# Altium schematic sheet isa_svga.SchDoc
size 431 x 279 mm
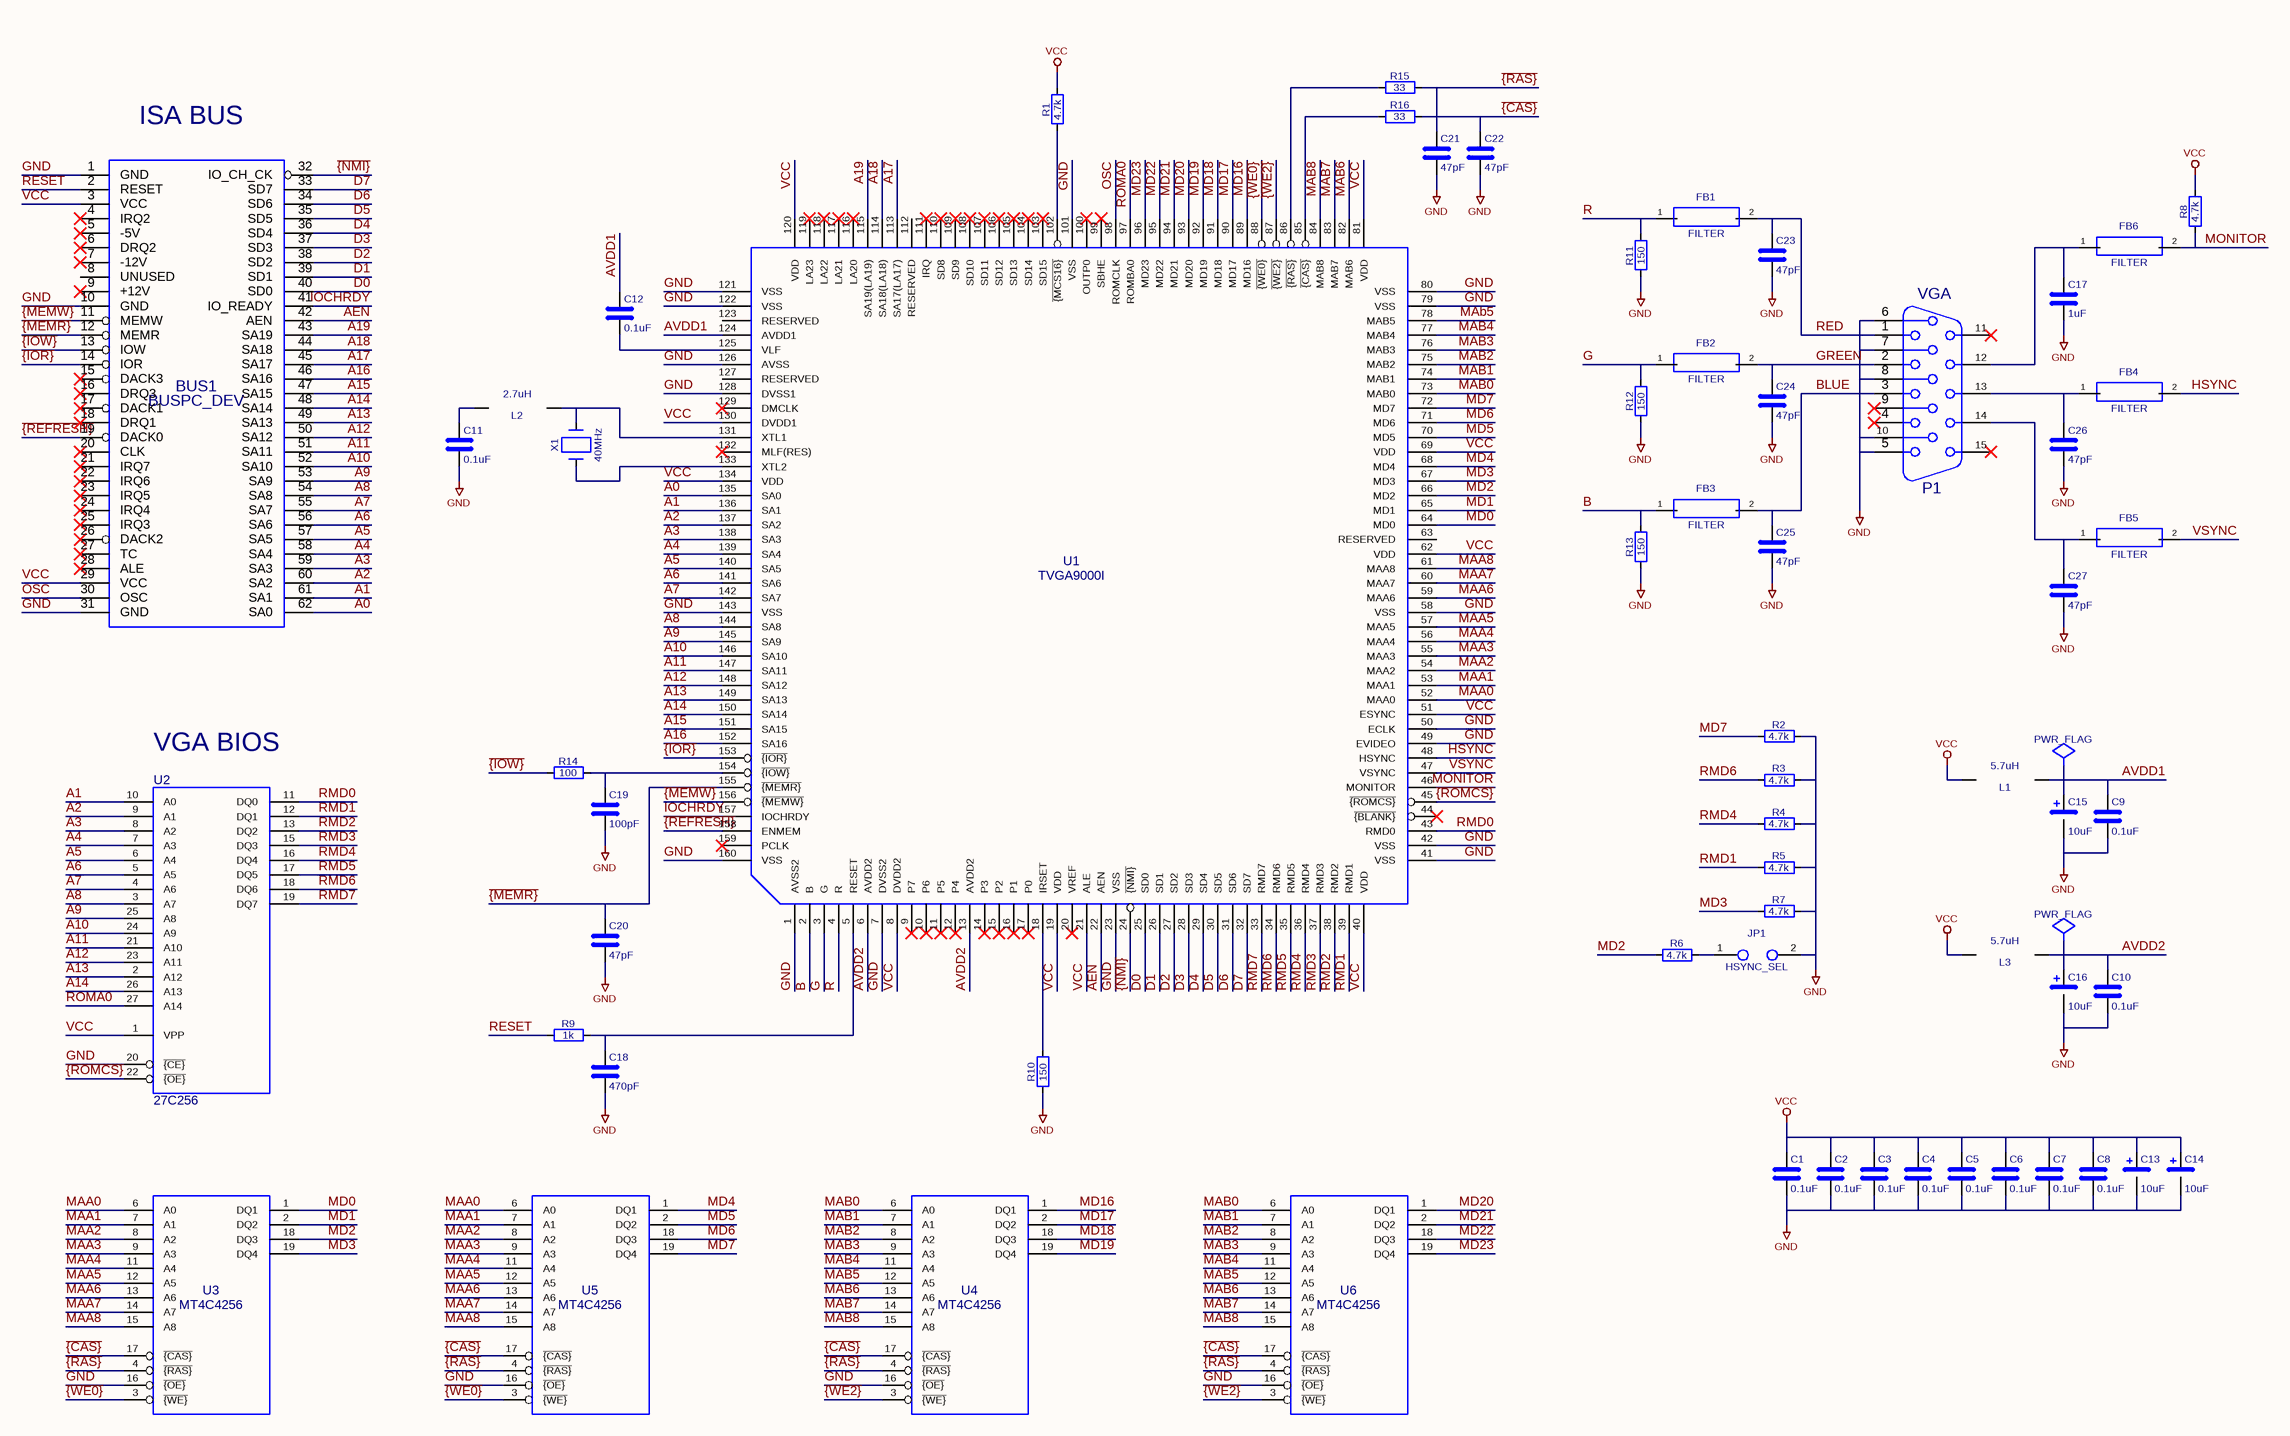
[diagram p0: isa_svga.SchDoc]

## Parts
#FLG021  PWR_FLAG  (graphical)
#FLG022  PWR_FLAG  (graphical)
BUS1  BUSPC_DEV  [Conn_Edge_ISA8]
C1  0.1uF  [Cap_Cer_508]
C2  0.1uF  [Cap_Cer_508]
C3  0.1uF  [Cap_Cer_508]
C4  0.1uF  [Cap_Cer_508]
C5  0.1uF  [Cap_Cer_508]
C6  0.1uF  [Cap_Cer_508]
C7  0.1uF  [Cap_Cer_508]
C8  0.1uF  [Cap_Cer_508]
C9  0.1uF  [Cap_Cer_508]
C10  0.1uF  [Cap_Cer_508]
C11  0.1uF  [Cap_Cer_508]
C12  0.1uF  [Cap_Cer_508]
C13  10uF  [Cap_Tant_508]
C14  10uF  [Cap_Tant_508]
C15  10uF  [Cap_Tant_508]
C16  10uF  [Cap_Tant_508]
C17  1uF  [Cap_Cer_508]
C18  470pF  [Cap_Cer_508]
C19  100pF  [Cap_Cer_508]
C20  47pF  [Cap_Cer_508]
C21  47pF  [Cap_Cer_508]
C22  47pF  [Cap_Cer_508]
C23  47pF  [Cap_Cer_508]
C24  47pF  [Cap_Cer_508]
C25  47pF  [Cap_Cer_508]
C26  47pF  [Cap_Cer_508]
C27  47pF  [Cap_Cer_508]
FB1  FILTER  [Res_1016]
FB2  FILTER  [Res_1016]
FB3  FILTER  [Res_1016]
FB4  FILTER  [Res_1016]
FB5  FILTER  [Res_1016]
FB6  FILTER  [Res_1016]
JP1  HSYNC_SEL  [Conn_Pin_Header_2x1_2.54mm_NoKey]
L1  5.7uH  [Res_1016]
L2  2.7uH  [Res_1016]
L3  5.7uH  [Res_1016]
P1  VGA  [Conn_Dsub_DE15F]
R1  4.7k  [Res_762]
R2  4.7k  [Res_762]
R3  4.7k  [Res_762]
R4  4.7k  [Res_762]
R5  4.7k  [Res_762]
R6  4.7k  [Res_762]
R7  4.7k  [Res_762]
R8  4.7k  [Res_762]
R9  1k  [Res_762]
R10  150  [Res_762]
R11  150  [Res_762]
R12  150  [Res_762]
R13  150  [Res_762]
R14  100  [Res_762]
R15  33  [Res_762]
R16  33  [Res_762]
U1  TVGA9000I  [IC_PQFP-160]
U2  27C256  [IC_DIP28_600]
U3  MT4C4256  [IC_DIP20_300]
U4  MT4C4256  [IC_DIP20_300]
U5  MT4C4256  [IC_DIP20_300]
U6  MT4C4256  [IC_DIP20_300]
X1  40MHz  [Crystal_HC-49U_Vert]

## Nets
GND: BUS1.1(GND) BUS1.10(GND) BUS1.31(GND) C1.2 C2.2 C3.2 C4.2 C5.2 C6.2 C7.2 C8.2 C9.2 C10.2 C11.2 C13.2 C14.2 C15.2 C16.2 C17.2 C18.2 C19.2 C20.2 C21.2 C22.2 C23.2 C24.2 C25.2 C26.2 C27.2 JP1.2 P1.5 P1.6(P6) P1.7(P7) P1.8(P8) P1.10 R2.2 R3.2 R4.2 R5.2 R7.2 R10.2 R11.2 R12.2 R13.2 U1.1(AVSS2) U1.7(DVSS2) U1.23(VSS) U1.41(VSS) U1.42(VSS) U1.49(EVIDEO) U1.50(ECLK) U1.58(VSS) U1.79(VSS) U1.80(VSS) U1.101(VSS) U1.121(VSS) U1.122(VSS) U1.126(AVSS) U1.128(DVSS1) U1.143(VSS) U1.160(VSS) U2.20(~{{CE}}) U3.16(~{{OE}}) U4.16(~{{OE}}) U5.16(~{{OE}}) U6.16(~{{OE}})
VCC: BUS1.3(VCC) BUS1.29(VCC) C1.1 C2.1 C3.1 C4.1 C5.1 C6.1 C7.1 C8.1 C13.1 C14.1 L1.1 L3.1 R1.2 R8.2 U1.8(DVDD2) U1.19(VDD) U1.21(ALE) U1.40(VDD) U1.51(ESYNC) U1.62(VDD) U1.69(VDD) U1.81(VDD) U1.120(VDD) U1.130(DVDD1) U1.134(VDD) U2.1(VPP)
A0: BUS1.62(SA0) U1.135(SA0)
A1: BUS1.61(SA1) U1.136(SA1) U2.10(A0)
A2: BUS1.60(SA2) U1.137(SA2) U2.9(A1)
A3: BUS1.59(SA3) U1.138(SA3) U2.8(A2)
A4: BUS1.58(SA4) U1.139(SA4) U2.7(A3)
A5: BUS1.57(SA5) U1.140(SA5) U2.6(A4)
A6: BUS1.56(SA6) U1.141(SA6) U2.5(A5)
A7: BUS1.55(SA7) U1.142(SA7) U2.4(A6)
A8: BUS1.54(SA8) U1.144(SA8) U2.3(A7)
A9: BUS1.53(SA9) U1.145(SA9) U2.25(A8)
A10: BUS1.52(SA10) U1.146(SA10) U2.24(A9)
A11: BUS1.51(SA11) U1.147(SA11) U2.21(A10)
A12: BUS1.50(SA12) U1.148(SA12) U2.23(A11)
A13: BUS1.49(SA13) U1.149(SA13) U2.2(A12)
A14: BUS1.48(SA14) U1.150(SA14) U2.26(A13)
A15: BUS1.47(SA15) U1.151(SA15)
A16: BUS1.46(SA16) U1.152(SA16)
A17: BUS1.45(SA17) U1.113(SA17(LA17))
A18: BUS1.44(SA18) U1.114(SA18(LA18))
A19: BUS1.43(SA19) U1.115(SA19(LA19))
AEN: BUS1.42(AEN) U1.22(AEN)
AVDD1: #FLG021.1(pwr) C9.1 C12.1 C15.1 L1.2 U1.124(AVDD1)
AVDD2: #FLG022.1(pwr) C10.1 C16.1 L3.2 U1.6(AVDD2) U1.13(AVDD2)
B: FB3.1 R13.1 U1.2(B)
BLUE: C25.1 FB3.2 P1.3
D0: BUS1.40(SD0) U1.25(SD0)
D1: BUS1.39(SD1) U1.26(SD1)
D2: BUS1.38(SD2) U1.27(SD2)
D3: BUS1.37(SD3) U1.28(SD3)
D4: BUS1.36(SD4) U1.29(SD4)
D5: BUS1.35(SD5) U1.30(SD5)
D6: BUS1.34(SD6) U1.31(SD6)
D7: BUS1.33(SD7) U1.32(SD7)
G: FB2.1 R12.1 U1.3(G)
GREEN: C24.1 FB2.2 P1.2
HSYNC: FB4.2 U1.48(HSYNC)
IOCHRDY: BUS1.41(IO_READY) U1.157(IOCHRDY)
MAA0: U1.52(MAA0) U3.6(A0) U5.6(A0)
MAA1: U1.53(MAA1) U3.7(A1) U5.7(A1)
MAA2: U1.54(MAA2) U3.8(A2) U5.8(A2)
MAA3: U1.55(MAA3) U3.9(A3) U5.9(A3)
MAA4: U1.56(MAA4) U3.11(A4) U5.11(A4)
MAA5: U1.57(MAA5) U3.12(A5) U5.12(A5)
MAA6: U1.59(MAA6) U3.13(A6) U5.13(A6)
MAA7: U1.60(MAA7) U3.14(A7) U5.14(A7)
MAA8: U1.61(MAA8) U3.15(A8) U5.15(A8)
MAB0: U1.73(MAB0) U4.6(A0) U6.6(A0)
MAB1: U1.74(MAB1) U4.7(A1) U6.7(A1)
MAB2: U1.75(MAB2) U4.8(A2) U6.8(A2)
MAB3: U1.76(MAB3) U4.9(A3) U6.9(A3)
MAB4: U1.77(MAB4) U4.11(A4) U6.11(A4)
MAB5: U1.78(MAB5) U4.12(A5) U6.12(A5)
MAB6: U1.82(MAB6) U4.13(A6) U6.13(A6)
MAB7: U1.83(MAB7) U4.14(A7) U6.14(A7)
MAB8: U1.84(MAB8) U4.15(A8) U6.15(A8)
MD0: U1.64(MD0) U3.1(DQ1)
MD1: U1.65(MD1) U3.2(DQ2)
MD2: R6.1 U1.66(MD2) U3.18(DQ3)
MD3: R7.1 U1.67(MD3) U3.19(DQ4)
MD4: U1.68(MD4) U5.1(DQ1)
MD5: U1.70(MD5) U5.2(DQ2)
MD6: U1.71(MD6) U5.18(DQ3)
MD7: R2.1 U1.72(MD7) U5.19(DQ4)
MD16: U1.89(MD16) U4.1(DQ1)
MD17: U1.90(MD17) U4.2(DQ2)
MD18: U1.91(MD18) U4.18(DQ3)
MD19: U1.92(MD19) U4.19(DQ4)
MD20: U1.93(MD20) U6.1(DQ1)
MD21: U1.94(MD21) U6.2(DQ2)
MD22: U1.95(MD22) U6.18(DQ3)
MD23: U1.96(MD23) U6.19(DQ4)
MONITOR: FB6.2 R8.1 U1.46(MONITOR)
OSC: BUS1.30(OSC) U1.98(ROMCLK)
R: FB1.1 R11.1 U1.4(R)
RED: C23.1 FB1.2 P1.1
RESET: BUS1.2(RESET) R9.1
RMD0: U1.43(RMD0) U2.11(DQ0)
RMD1: R5.1 U1.39(RMD1) U2.12(DQ1)
RMD2: U1.38(RMD2) U2.13(DQ2)
RMD3: U1.37(RMD3) U2.15(DQ3)
RMD4: R4.1 U1.36(RMD4) U2.16(DQ4)
RMD5: U1.35(RMD5) U2.17(DQ5)
RMD6: R3.1 U1.34(RMD6) U2.18(DQ6)
RMD7: U1.33(RMD7) U2.19(DQ7)
ROMA0: U1.97(ROMBA0) U2.27(A14)
VSYNC: FB5.2 U1.47(VSYNC)
~{{CAS}}: C22.1 R16.2 U3.17(~{{CAS}}) U4.17(~{{CAS}}) U5.17(~{{CAS}}) U6.17(~{{CAS}})
~{{IOR}}: BUS1.14(IOR) U1.153(~{{IOR}})
~{{IOW}}: BUS1.13(IOW) R14.1
~{{MEMR}}: BUS1.12(MEMR) C20.1 U1.155(~{{MEMR}})
~{{MEMW}}: BUS1.11(MEMW) U1.156(~{{MEMW}})
~{{NMI}}: BUS1.32(IO_CH_CK) U1.24(~{{NMI}})
~{{RAS}}: C21.1 R15.2 U3.4(~{{RAS}}) U4.4(~{{RAS}}) U5.4(~{{RAS}}) U6.4(~{{RAS}})
~{{REFRESH}}: BUS1.19(DACK0) U1.158(ENMEM)
~{{ROMCS}}: U1.45(~{{ROMCS}}) U2.22(~{{OE}})
~{{WE0}}: U1.88(~{{WE0}}) U3.3(~{{WE}}) U5.3(~{{WE}})
~{{WE2}}: U1.87(~{{WE2}}) U4.3(~{{WE}}) U6.3(~{{WE}})
NetC11_1: C11.1 L2.1
NetC12_2: C12.2 U1.125(VLF)
NetC17_1: C17.1 FB6.1 P1.12
NetC18_1: C18.1 R9.2 U1.5(RESET)
NetC19_1: C19.1 R14.2 U1.154(~{{IOW}})
NetC26_1: C26.1 FB4.1 P1.13
NetC27_1: C27.1 FB5.1 P1.14
NetJP1_1: JP1.1 R6.2
NetL2_2: L2.2 U1.131(XTL1) X1.2
NetR1_1: R1.1 U1.102(~{{MCS16}})
NetR10_1: R10.1 U1.18(IRSET)
NetR15_1: R15.1 U1.86(~{{RAS}})
NetR16_1: R16.1 U1.85(~{{CAS}})
NetU1_133: U1.133(XTL2) X1.1

Not connected (* = marked no-connect by the designer): BUS1 4(IRQ2)* 5(-5V)* 6(DRQ2)* 7(-12V)* 8(UNUSED) 9(+12V)* 15(DACK3)* 16(DRQ3)* 17(DACK1)* 18(DRQ1)* 20(CLK)* 21(IRQ7)* 22(IRQ6)* 23(IRQ5)* 24(IRQ4)* 25(IRQ3)* 26(DACK2)* 27(TC)* 28(ALE)*; P1 4* 9(P9)* 11* 15*; U1 9(P7)* 10(P6)* 11(P5)* 12(P4)* 14(P3)* 15(P2)* 16(P1)* 17(P0)* 20(VREF)* 44(~{{BLANK}})* 63(RESERVED) 99(SBHE)* 100(OUTP0)* 103(SD15)* 104(SD14)* 105(SD13)* 106(SD12)* 107(SD11)* 108(SD10)* 109(SD9)* 110(SD8)* 111(IRQ)* 112(RESERVED) 116(LA20)* 117(LA21)* 118(LA22)* 119(LA23)* 123(RESERVED) 127(RESERVED) 129(DMCLK)* 132(MLF(RES))* 159(PCLK)*; U2 14(GND) 28(VCC); U3 5(NC) 10(VCC) 20(GND); U4 5(NC) 10(VCC) 20(GND); U5 5(NC) 10(VCC) 20(GND); U6 5(NC) 10(VCC) 20(GND)

## Notes on the sheet
- (near BUS1) ISA BUS
- (near U2) VGA BIOS
- 1
- 2
- 3
- 4
- 5
- 6
- 7
- 8
- A
- B
- C
- D
- E
- Title:
- File: isa_svga.kicad_sch
- Sheet: /
- KiCad E.D.A.  kicad (5.1.4)-1
- Size: User
- Date: 7 feb 2013
- Rev:
- Id: 1/1

## Library data of the parts
C1-C12 C17-C27 = C: Footprint: my_components:Cap_Cer_508
  C1-C12: Value: 0.1uF
  C17: Value: 1uF
  C18: Value: 470pF
  C19: Value: 100pF
  C20-C27: Value: 47pF
C13-C16 = CP1: Value: 10uF; Footprint: my_components:Cap_Tant_508
JP1 = JUMPER: Value: HSYNC_SEL; Footprint: my_components:Conn_Pin_Header_2x1_2.54mm_NoKey
L1-L3 = INDUCTOR: Footprint: my_components:Res_1016
  L1 L3: Value: 5.7uH
  L2: Value: 2.7uH
P1 = DE15: Value: VGA; Footprint: my_components:Conn_Dsub_DE15F
R1-R16 = R: Footprint: my_components:Res_762
  R1-R8: Value: 4.7k
  R9: Value: 1k
  R10-R13: Value: 150
  R14: Value: 100
  R15 R16: Value: 33
X1 = Crystal: Value: 40MHz; Footprint: my_components:Crystal_HC-49U_Vert
#FLG021 #FLG022 = PWR_FLAG: Value: PWR_FLAG
BUS1 = BUSPC_DEV: Value: BUSPC_DEV; Footprint: my_components:Conn_Edge_ISA8
FB1-FB6 = FILTER: Value: FILTER; Footprint: my_components:Res_1016
U1 = TVGA9000I: Value: TVGA9000I; Footprint: my_components:IC_PQFP-160
U2 = 27C256: Value: 27C256; Footprint: my_components:IC_DIP28_600
U3-U6 = MT4C4256: Value: MT4C4256; Footprint: my_components:IC_DIP20_300